# Altium schematic sheet CAN.SchDoc: CAN
size 431 x 279 mm; Author: Alberto Marrone, Christian Schmitz, Leo Walter; DrawnBy: Alberto Marrone, Christian Schmitz, Leo Walter; Engineer: Alberto Marrone, Christian Schmitz, Leo Walter; Revision: V1.0; SheetNumber: 3; Project: PCB Design Final Project
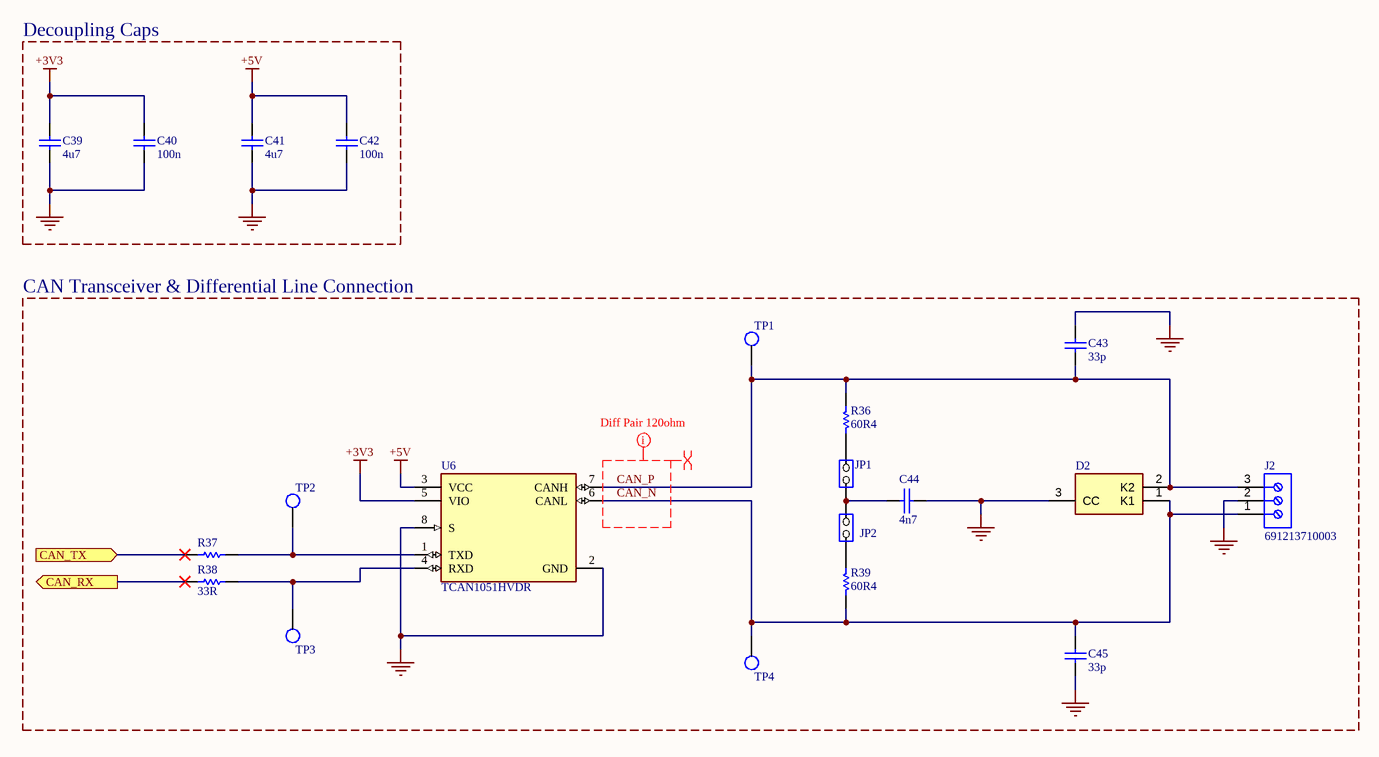
[diagram p0: CAN.SchDoc]

## Parts
C39  4u7  [0603C]
C40  100n  [0603C]
C41  4u7  [0603C]
C42  100n  [0603C]
C43  33p  [0603C]
C44  4n7  [0603C]
C45  33p  [0603C]
D2  PESD2CANFD24LT-QR  [SOT95P230X110-3N]  (value not drawn)
J2  691213710003  [691213710003]
JP1  (no value)  [HDR_1x2_2R54_V_M_S]
JP2  (no value)  [HDR_1x2_2R54_V_M_S]
R36  60R4  [0603R]
R37  33R  [0603R]  (value not drawn)
R38  33R  [0603R]
R39  60R4  [0603R]
TP1  Test Point  [TP_SMD_0.8]  (value not drawn)  (no BOM)
TP2  Test Point  [TP_SMD_0.8]  (value not drawn)  (no BOM)
TP3  Test Point  [TP_SMD_0.8]  (value not drawn)  (no BOM)
TP4  Test Point  [TP_SMD_0.8]  (value not drawn)  (no BOM)
U6  TCAN1051HVDR  [FP-D0008B-IPC_B]

## Blocks framed on the sheet
Decoupling Caps: C39-C42
CAN Transceiver & Differential Line Connection: C43-C45 D2 J2 JP1 JP2 R36-R39 TP1-TP4 U6

## Ports
CAN_RX (out), CAN_TX (in)

## Nets
+3V3: C39.1 C40.1 U6.5(VIO)
+5V: C41.1 C42.1 U6.3(VCC)
GND: C39.2 C40.2 C41.2 C42.2 C43.2 C44.2 C45.1 D2.3(CC) J2.2 U6.2(GND) U6.8(S)
CAN_N: C45.2 D2.1(K1) J2.1 R39.1 TP4.1 U6.6(CANL)
CAN_P: C43.1 D2.2(K2) J2.3 R36.2 TP1.1 U6.7(CANH)
CAN_RX: R38.1 ; port CAN_RX
CAN_TX: R37.1 ; port CAN_TX
NetC44_1: C44.1 JP1.1(COMMON) JP2.2(NO)
NetJP1_2: JP1.2(NO) R36.1
NetJP2_1: JP2.1(COMMON) R39.2
NetR37_2: R37.2 TP2.1 U6.1(TXD)
NetR38_2: R38.2 TP3.1 U6.4(RXD)

## Layout directives
differential pair: CAN_N, CAN_P
net class CAN_Diff: CAN_N, CAN_P

## Notes on the sheet
- DWG. NO.
- REV.
- SHT.
- THIS DOCUMENT AND THE DATA DISCLOSED HEREIN OR HEREWITH IS THE PROPERTY OF ALTIUM LIMITED AND MAY BE FREELY DISTRIBUTED IN WHOLE. NO RIGHTS ARE RESERVED OR EXPRESS OR IMPLIED WARANTEE GIVEN.
- REVISION
- DESCRIPTION
- DATE
- APPROVED
- ENG:
- APPROVALS
- PROJECT
- DSN:
- CHK:
- REFERENCE DOCUMENTS
- PROJECT REVISION:
- TITLE
- DOCUMENT REVISION:
- DESIGN ITEM:
- BOM:
- FAB DWG:
- PCB DWG:
- ASSY DWG:
- SCALE:
- SIZE
- B
- CAGE CODE
- FILE NAME
- DWG NO.
- SHEET
- OF
- REV

## Library data of the parts
C39 C41 = CAP SMD 0603  X5R 1µF 25V 10%: Capacitor; Rated voltage: 25V; Tolerance: 10%; Dielectric: X5R; Manufacturer: *; Manufacturer P/N: *; Order code Farnell: 1288202RL; Value: 4u7; Power: *; Temperature  Factor: *; Temperature Max: +125°C; Temperature Min: -55°C; STS Code: *
C40 C42 = Cap: Capacitor; Dielectric: X7R; Published: 8-Jun-2000; Revision: July-2002: Re-released for DXP Platform.; Publisher: Altium Limited; Value: 100n
C43 C45 = Cap: Capacitor; Dielectric: C0G; Published: 8-Jun-2000; Revision: July-2002: Re-released for DXP Platform.; Publisher: Altium Limited; Value: 33p; Supplier 1: DigiKey; Supplier Part Number 1: 720-1913-1-ND
C44 = CAP: Capacitor; Dielectric: C0G; Value: 4n7; Supplier 1: Arrow Electronics; Supplier Part Number 1: C0603C472K5GACTU
D2 = PESD2CANFD24LT-QR: vp_PESD2CANFD24LT-Q - ESD protection for In-vehicle networks@en-us; Manufacturer_Name: Nexperia; Geometry.Height: 1.1mm; Manufacturer_Part_Number: PESD2CANFD24LT-QR; Mouser Part Number: 771-PESD2CANFD24LTQR; Mouser Price/Stock: https://www.mouser.co.uk/ProductDetail/Nexperia/PESD2CANFD24LT-QR?qs=vvQtp7zwQdPkdQ8USTElVw%3D%3D; Arrow Part Number: PESD2CANFD24LT-QR; Arrow Price/Stock: https://www.arrow.com/en/products/pesd2canfd24lt-qr/nexperia?utm_currency=USD&region=europe; Datasheet Link: https://assets.nexperia.com/documents/data-sheet/PESD2CANFD24LT-Q.pdf
J2 = CMP-1502-02527-3: 213 Series 5MM Pitch Straight, Pcb Terminal Block, Through Hole, 3 Way; Stripping Length: -7mm; Wire Gauge (Max): 26AWG; Pitch: 5.0038mm; Voltage: 300V; Current: 10A; Wire/Cable Gauge: 16AWG; Connector Type: PCB, Terminal Block; Plating: Brass, Steel; Number of Positions Per Level: 3; Number of Levels: 1; Height: 10mm; Housing Material: Nylon; Termination: Screw; RoHS: Compliant; Max Operating Temperature: 105°C; Contact Plating: Tin; Contact Material: Brass; Number of Pins: 3; Color: Green; Length: 8.3mm; REACH SVHC: Unknown; Packaging: Box; Wire Gauge (Min): 16AWG; Min Operating Temperature: -40°C; Lead Pitch: 5mm; Number of Contacts: 3; Width: 15.6mm; Mount: Through Hole
JP1 JP2 = JP2
R36 R39 = res1: Resistor; Published: 8-Jun-2000; Revision: July-2002: Re-released for DXP Platform.; Publisher: Altium Limited; Value: 60R4; Supplier 1: Farnell; Supplier Part Number 1: CRCW060360R4FKTA
R37 R38 = res1: Resistor; Tolerance: 1%; Published: 8-Jun-2000; Revision: July-2002: Re-released for DXP Platform.; Publisher: Altium Limited; Value: 33R
TP1-TP4 = Test_Point
U6 = CMP-04872-000066-1: IC TRANSCEIVER HALF 1/1 8SOIC; Min Supply Voltage: 4.5V; Max Supply Voltage: 5.5V; Interface: CAN; Min Operating Temperature: -55°C; Packaging: Cut Tape; Case/Package: SOIC; Max Operating Temperature: 125°C; RoHS Compliant: Yes; REACH SVHC: No SVHC; Number of Pins: 8; Lead Free: Lead Free